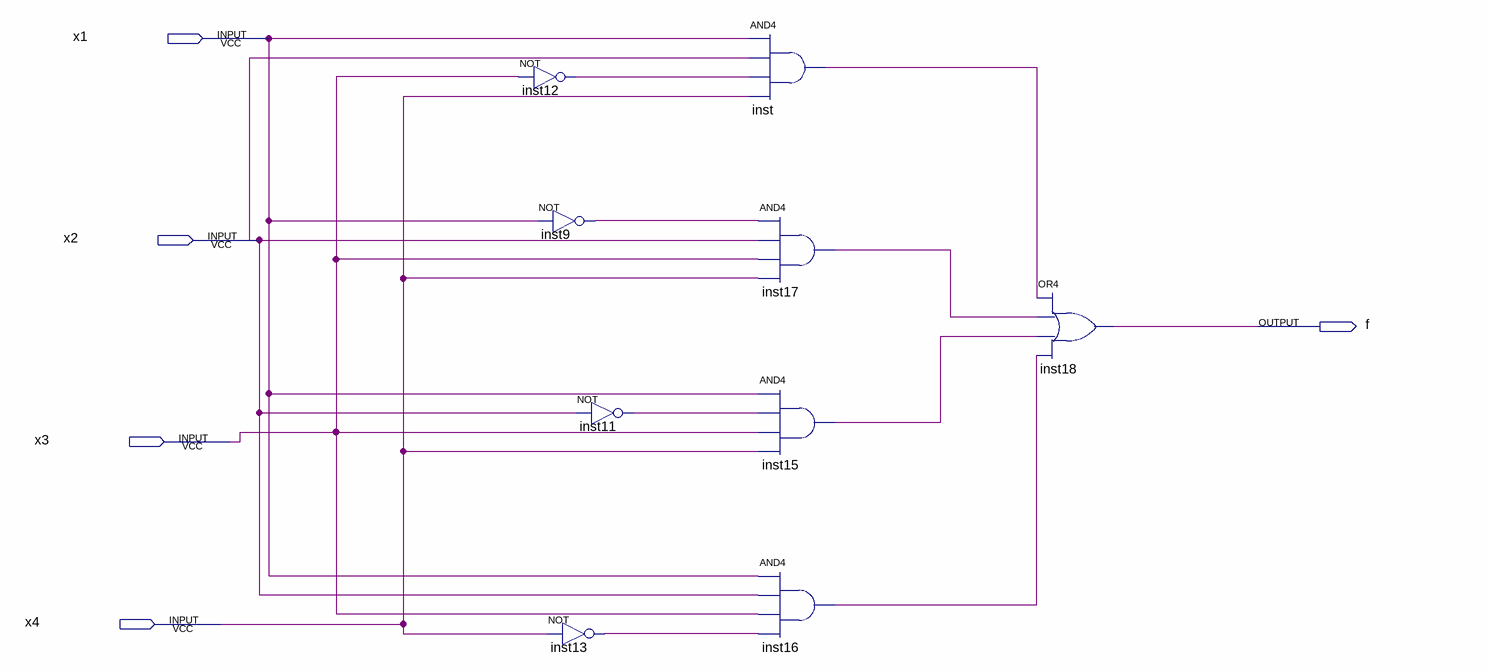
[diagram p0: schematic sheet]
// Quartus schematic ask2.bdf as structural Verilog: 9 symbols, 5 pins
module ask2 (
  input  x1,
  input  x2,
  input  x3,
  input  x4,
  output f
);

  wire inst9_out, inst11_out, inst12_out, inst13_out, inst15_out, inst16_out, inst17_out, inst_out;

  not inst12 (inst12_out, x3);
  not inst9 (inst9_out, x1);
  not inst13 (inst13_out, x4);
  not inst11 (inst11_out, x2);
  and inst (inst_out, x1, x2, inst12_out, x4);
  and inst17 (inst17_out, inst9_out, x2, x3, x4);
  and inst15 (inst15_out, x1, inst11_out, x3, x4);
  and inst16 (inst16_out, x1, x2, x3, inst13_out);
  or inst18 (f, inst_out, inst17_out, inst15_out, inst16_out);
endmodule
